# Altium schematic sheet Scheme VHF-Unit.SchDoc: VHF Unit
size A3; Date: 2018-03-27; DrawnBy: Josef Lundberg; Engineer: Josef Lundberg; Organization: Followit; DocumentNumber: 1; Revision: 1; SheetNumber: 1; SheetTotal: 1; Time: 2018-04-04; DocumentName: VHF Unit; ModifiedDate: 2018-04-04; ProjectName: VHF Unit
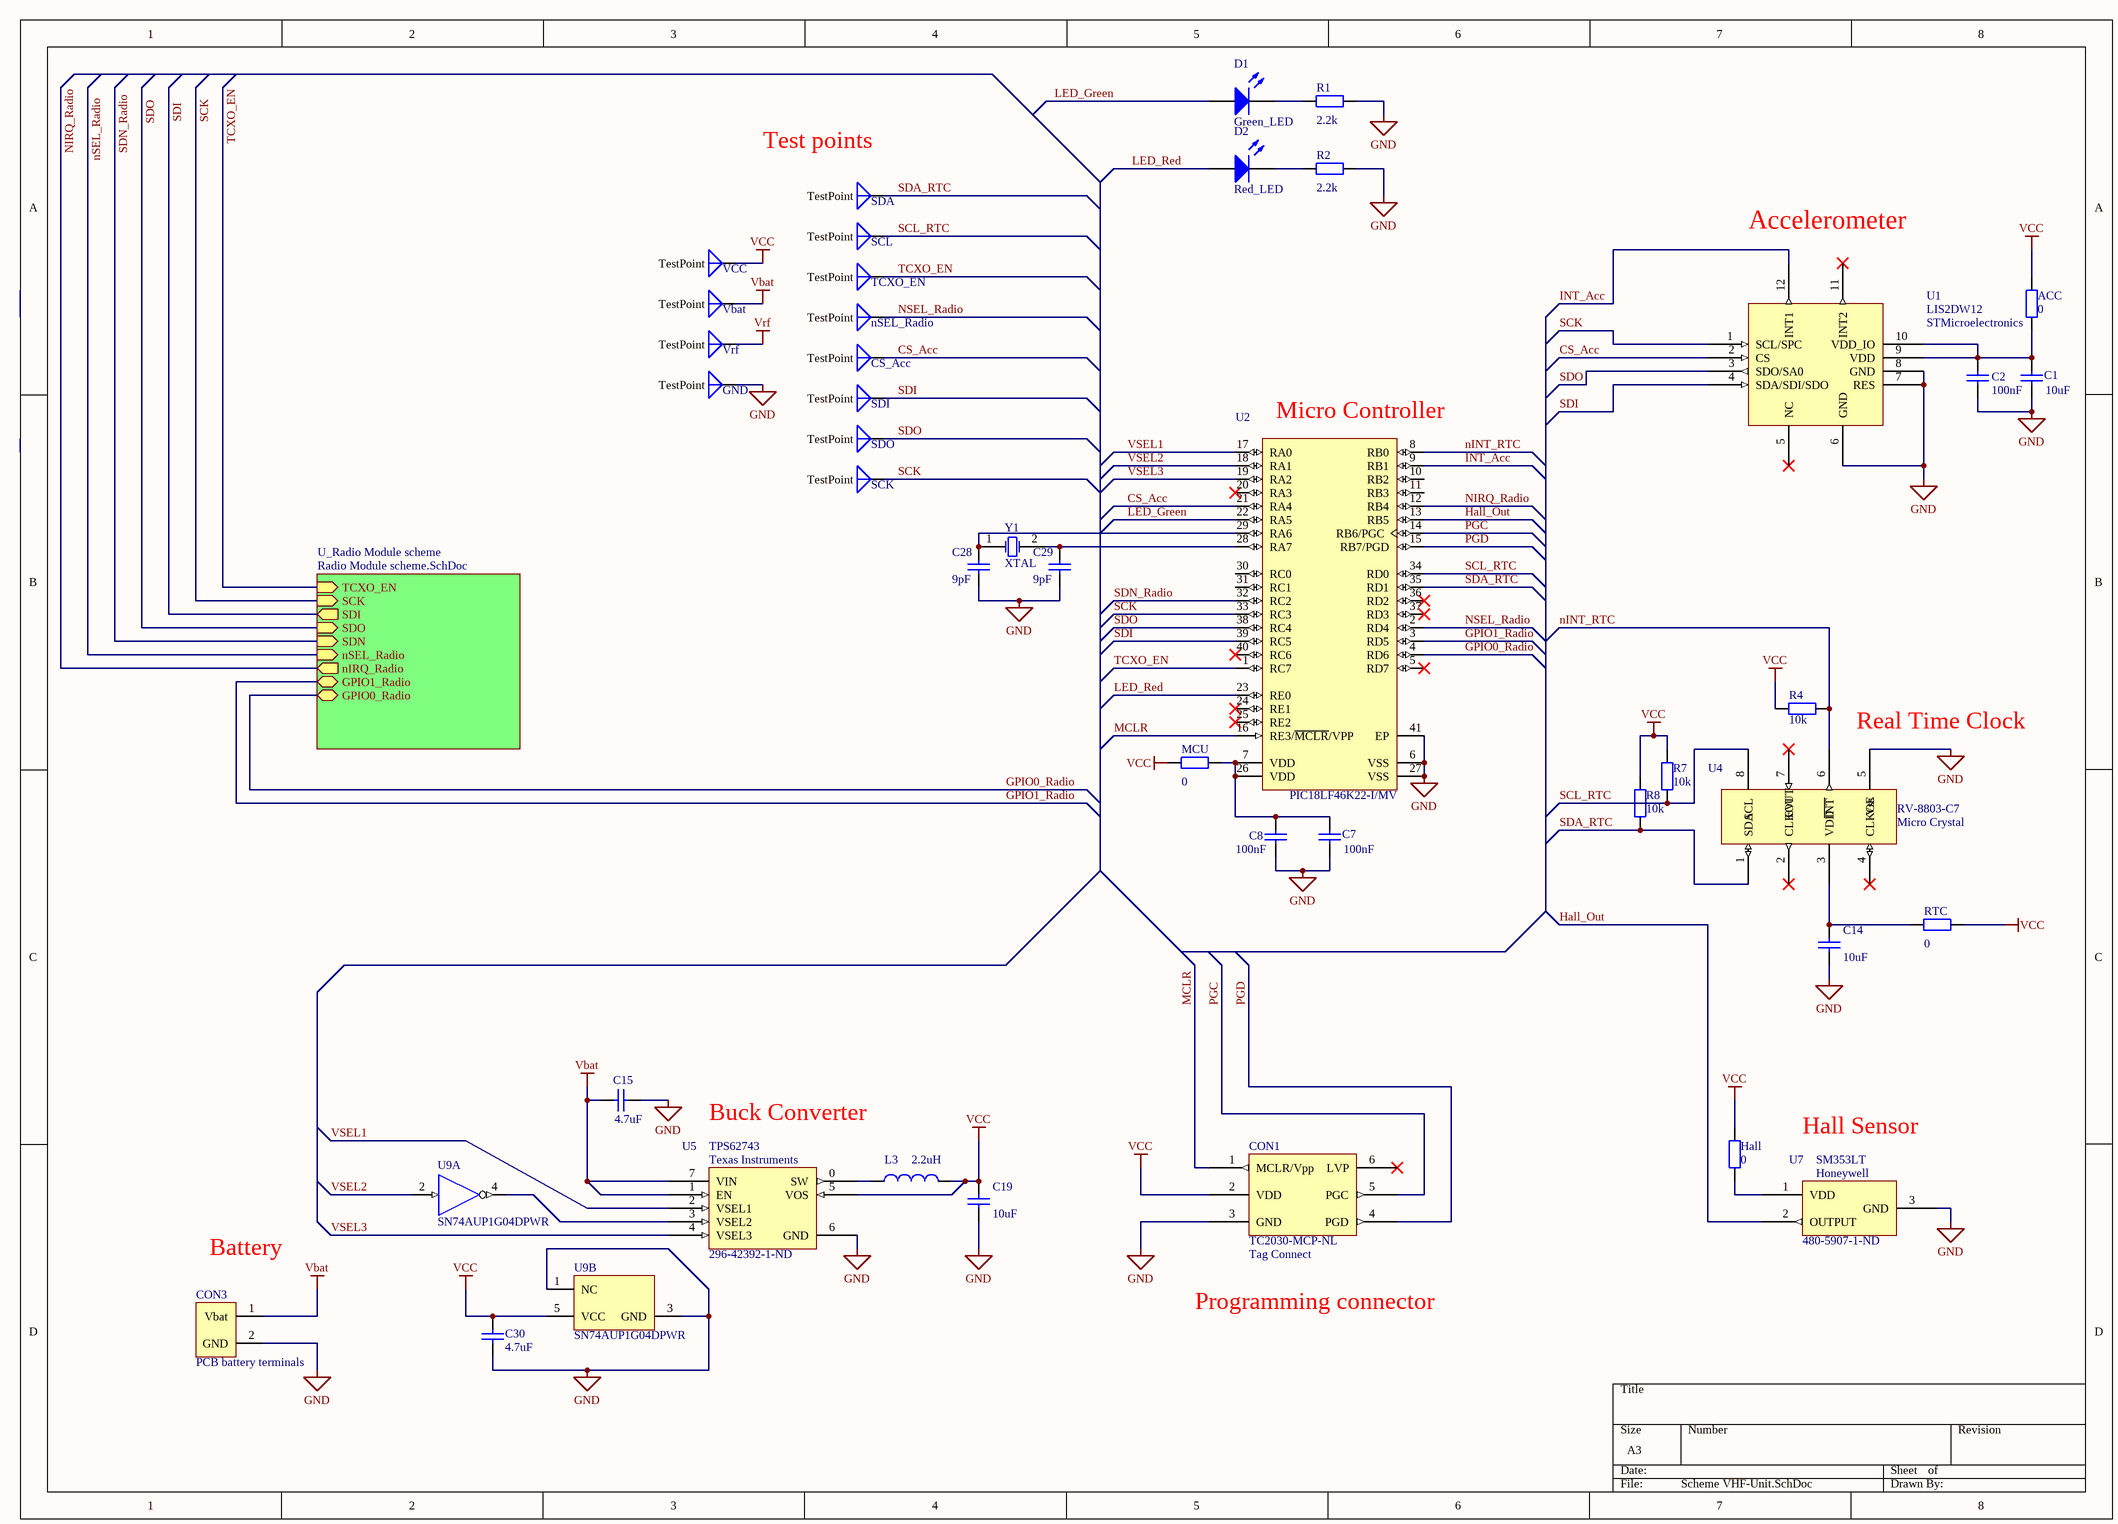
[diagram p0: Scheme VHF-Unit.SchDoc]

## Parts
ACC  value 0  [0402_SMD_RES_0_Ohm]  (hidden comment: Res2)
C1  value 10uF  [0402_CAP]
C2  value 100nF  [0402_CAP]
C7  value 100nF  [0402_CAP]  (hidden comment: Cap Semi)
C8  value 100nF  [0402_CAP]  (hidden comment: Cap Semi)
C14  value 10uF  [0402_CAP]  (hidden comment: Cap Semi)
C15  value 4.7uF  [0402_CAP]  (hidden comment: Cap Semi)
C19  value 10uF  [0402_CAP]  (hidden comment: Cap Semi)
C28  value 9pF  [0402_CAP]  (hidden comment: Cap Semi)
C29  value 9pF  [0402_CAP]  (hidden comment: Cap Semi)
C30  value 4.7uF  [0402_CAP]  (hidden comment: Cap Semi)
CON1  TC2030-MCP-NL  Mfr 1: Tag Connect  [TAG-CONNECT]
CON3  PCB battery terminals  [JST-PH]
CS_Acc  Antenna  [TestPoint]  (value not drawn)
D1  Green_LED  [0603_LED]
D2  Red_LED  [0603_LED]
GND  Antenna  [TestPoint]  (value not drawn)
Hall  value 0  [0402_SMD_RES_0_Ohm]  (hidden comment: Res2)
L3  value 2.2uH  [0402_CAP]  (hidden comment: Inductor)
MCU  value 0  [0402_SMD_RES_0_Ohm]  (hidden comment: Res2)
nSEL_Radio  Antenna  [TestPoint]  (value not drawn)
R1  value 2.2k  [0402_RES]  (hidden comment: Res2)
R2  value 2.2k  [0402_RES]  (hidden comment: Res2)
R4  value 10k  [0402_RES]  (hidden comment: Res2)
R7  value 10k  [0402_RES]  (hidden comment: Res2)
R8  value 10k  [0402_RES]  (hidden comment: Res2)
RTC  value 0  [0402_SMD_RES_0_Ohm]  (hidden comment: Res2)
SCK  Antenna  [TestPoint]  (value not drawn)
SCL  Antenna  [TestPoint]  (value not drawn)
SDA  Antenna  [TestPoint]  (value not drawn)
SDI  Antenna  [TestPoint]  (value not drawn)
SDO  Antenna  [TestPoint]  (value not drawn)
TCXO_EN  Antenna  [TestPoint]  (value not drawn)
U1  LIS2DW12  Mfr 1: STMicroelectronics  [LGA12C50P4X4_200X200X70 Low Density]
U2  PIC18LF46K22-I/MV  [MCHP-UQFN-MV40_M]
U4  RV-8803-C7  Mfr 1: Micro Crystal  [LGA8C90P4X2_320X150X80]
U5  TPS62743  Mfr 1: Texas Instruments  Supplier Part Number 1: 296-42392-1-ND  [BGA8C40P2X4_87X156X50]
U7  SM353LT  Mfr 1: Honeywell  Supplier Part Number 1: 480-5907-1-ND  [SOT95P280X140-3N]
U9  SN74AUP1G04DPWR  [DSF0006A_V]  (parts A,B of 2)
Vbat  Antenna  [TestPoint]  (value not drawn)
VCC  Antenna  [TestPoint]  (value not drawn)
Vrf  Antenna  [TestPoint]  (value not drawn)
Y1  XTAL  [ABS05-XTAL]

## Sub-sheets
U_Radio Module scheme = Radio Module scheme.SchDoc: TCXO_EN (in), SCK (in), SDI (out), SDO (in), SDN (in), nSEL_Radio (in), nIRQ_Radio (out), GPIO1_Radio (bidir), GPIO0_Radio (bidir)

## Nets
GND: C1.1 C2.1 C7.1 C8.1 C14.1 C15.1 C19.1 C28.1 C29.1 C30.1 CON1.3(GND) CON3.2(GND) GND.1(TestPoint) R1.2 R2.2 U1.6(GND) U1.7(RES) U1.8(GND) U2.6(VSS) U2.27(VSS) U2.41(EP) U4.5(Vss) U5.6(GND) U7.3(GND) U9.1(NC) U9.3(GND)
Vbat: C15.2 CON3.1(Vbat) U5.1(EN) U5.7(VIN) Vbat.1(TestPoint)
VCC: ACC.2 C19.2 C30.2 CON1.2(VDD) Hall.2 L3.2 MCU.1 R4.1 R7.2 R8.2 RTC.2 U5.5(VOS) U9.5(VCC) VCC.1(TestPoint)
Vrf: Vrf.1(TestPoint)
CS_Acc: CS_Acc.1(TestPoint) U1.2(CS) U2.21(RA4)
GPIO0_Radio: U2.4(RD6) ; sheet U_Radio Module scheme/GPIO0_Radio
GPIO1_Radio: U2.3(RD5) ; sheet U_Radio Module scheme/GPIO1_Radio
Hall_Out: U2.13(RB5) U7.2(OUTPUT)
INT_Acc: U1.12(INT1) U2.9(RB1)
LED_Green: D1.1(A) U2.22(RA5)
LED_Red: D2.1(A) U2.23(RE0)
MCLR: CON1.1(MCLR/Vpp) U2.16(RE3/~{MCLR}/VPP)
nINT_RTC: R4.2 U2.8(RB0) U4.6(~{INT})
NIRQ_Radio: U2.12(RB4) ; sheet U_Radio Module scheme/nIRQ_Radio
nSEL_Radio: nSEL_Radio.1(TestPoint) U2.2(RD4) ; sheet U_Radio Module scheme/nSEL_Radio
PGC: CON1.5(PGC) U2.14(RB6/PGC)
PGD: CON1.4(PGD) U2.15(RB7/PGD)
SCK: SCK.1(TestPoint) U1.1(SCL/SPC) U2.33(RC3) ; sheet U_Radio Module scheme/SCK
SCL_RTC: R7.1 SCL.1(TestPoint) U2.34(RD0) U4.8(SCL)
SDA_RTC: R8.1 SDA.1(TestPoint) U2.35(RD1) U4.1(SDA)
SDI: SDI.1(TestPoint) U1.4(SDA/SDI/SDO) U2.39(RC5) ; sheet U_Radio Module scheme/SDI
SDN_Radio: U2.32(RC2) ; sheet U_Radio Module scheme/SDN
SDO: SDO.1(TestPoint) U1.3(SDO/SA0) U2.38(RC4) ; sheet U_Radio Module scheme/SDO
TCXO_EN: TCXO_EN.1(TestPoint) U2.1(RC7) ; sheet U_Radio Module scheme/TCXO_EN
VSEL1: U2.17(RA0) U5.2(VSEL1)
VSEL2: U2.18(RA1) U9.2(A)
VSEL3: U2.19(RA2) U5.4(VSEL3)
NetACC_1: ACC.1 C1.2 C2.2 U1.9(VDD) U1.10(VDD_IO)
NetC7_2: C7.2 C8.2 MCU.2 U2.7(VDD) U2.26(VDD)
NetC14_2: C14.2 RTC.1 U4.3(VDD)
NetC28_2: C28.2 U2.29(RA6) Y1.1(OSC1)
NetC29_2: C29.2 U2.28(RA7) Y1.2(OSC2)
NetD1_2: D1.2(K) R1.1
NetD2_2: D2.2(K) R2.1
NetHall_1: Hall.1 U7.1(VDD)
NetL3_1: L3.1 U5.0(SW)
NetU5_3: U5.3(VSEL2) U9.4(Y)

Not connected (* = marked no-connect by the designer): CON1 6(LVP)*; U1 5(NC)* 11(INT2)*; U2 5(RD7)* 10(RB2) 11(RB3) 20(RA3)* 24(RE1)* 25(RE2)* 30(RC0) 31(RC1) 36(RD2)* 37(RD3)* 40(RC6)*; U4 2(CLKOUT)* 4(CLKOE)* 7(EVI)*

## Notes on the sheet
- (near SDA) Test points
- Accelerometer
- (near U2) Micro Controller
- Real Time Clock
- Buck Converter
- Hall Sensor
- Battery
- Programming connector

## Library data of the parts
ACC Hall MCU R1 R2 R4 R7 R8 RTC = Res2: Resistor; Published: 8-Jun-2000; LatestRevisionDate: 17-Jul-2002; LatestRevisionNote: Re-released for DXP Platform.; PackageReference: AXIAL-0.4; Publisher: Altium Limited; PackageDescription: Axial Device, Thru-Hole; 2 Leads; 0.4 in Pin Spacing
  ACC Hall RTC: Supplier 1: Digi-Key; Supplier Part Number 1: 311-0.0LBCT-ND
  R4 R7 R8: Supplier 1: Digi-Key; Supplier Part Number 1: 311-2217-1-ND
C1 C2 C7 C8 C14 C15 C19 C28-C30 = Cap Semi: Capacitor (Semiconductor SIM Model); Published: 8-Jun-2000; LatestRevisionDate: 29-May-2009; LatestRevisionNote: IPC-7351 Footprint Added.; PackageReference: C1206; Publisher: Altium Limited; PackageDescription: Chip Capacitor
  C7 C8 C28 C29: Supplier 1: Farnell; Supplier 2: Digi-Key
CON1 = TC2030-MCP-NL: Tag Connect programming connector
CON3 = Battery connenctor: 2 pin Battery Connectors
CS_Acc GND nSEL_Radio SCK SCL SDA SDI SDO TCXO_EN Vbat VCC Vrf = TestPoint: Testpoint connector
D1 D2 = LED2: Typical RED, GREEN, YELLOW, AMBER GaAs LED; Published: 8-Jun-2000; LatestRevisionDate: 17-Jul-2002; LatestRevisionNote: Re-released for DXP Platform.; PackageVersion: Feb-2002; PackageReference: 3.2X1.6X1.1; Publisher: Altium Limited; PackageDescription: SM LED; 2 Flat Leads
L3 = Inductor: Code_IEC: 1005; Published: 8-Jun-2000; LatestRevisionDate: 29-May-2009; LatestRevisionNote: IPC-7351 Footprint Added.; PackageReference: 0402-A; Publisher: Altium Limited; PackageDescription: Chip Inductor; Code_JEITA: 0402
U1 = LIS2DW12: Digital output motion sensor 3-axis
U2 = PIC18LF46K22-I/MV: Low-Power, High-Performance Microcontroller with XLP Technology, 16 MHz, 35 I/O, -40 to 85 degC, 40-pin UQFN (MV40), Tube; Manufacturer: Microchip; # of A/D Channels: 28; Digital Communication: 2-A/E/USART, 2-MSSP(SPI/I2C); EEPROM Data Memory (bytes): 1024; I/O Pins: 35; Internal Oscillator: 16 MHz, 31 kHz; Max. CPU Speed MHz: 16; Memory Type: Flash; Operation Voltage Range: 1.8V - 3.6V; Program Memory KBytes: 64; Program Memory KWords: 32; RAM: 3896; Timers: 3 - 8-bit, 4 - 16-bit; DatasheetVersion: Rev. F; PackageVersion: C04-156A, 04/2013; PackageReference: UQFN-MV40; PackageDescription: 40-Lead Plastic Ultra Thin Quad Flat, No Lead Package, Body 5 x 5 mm, Pitch 0.4 mm; Supplier 1: Digi-Key; Supplier Part Number 1: PIC18LF46K22-I/MV-ND; Supplier 2: Farnell; Supplier Part Number 2: 2318031; Supplier 3: Newark; Supplier Part Number 3: 23T3186; Supplier 4: Mouser; Supplier Part Number 4: 579-PIC18LF46K22-IMV; Packing: TUBE; Mounting Technology: Surface Mount; PartNumber: PIC18LF46K22-I/MV; ComponentLink1Description: Datasheet; ComponentLink1URL: http://ww1.microchip.com/downloads/en/DeviceDoc/41412F.pdf; ComponentLink2Description: Package Specification; ComponentLink2URL: http://www.microchip.com/stellent/groups/techpub_sg/documents/packagingspec/en012702.pdf; ComponentLink3Description: URL Link1; ComponentLink3URL: Product URL:http://www.microchip.com/datasheet/PIC18F46K22
U5 = TPS62743: High EfficiencyBuck Converterwith Ultra-lowQuiescentCurrent; Supplier 1: Digi-Key
U7 = SM353LT: Magnetoresistive Sensor ICs; Supplier 1: Digi-Key
U9 = SN74AUP1G04DPWR: Low-Power Single Inverter Gate, DPW0004A, LARGE T&R; Manufacturer: Texas Instruments; VCC(Min)(V): 0.8; VCC(Max)(V): 3.6; Output Type: CMOS; ICC @ Nom Voltage(Max)(mA): 0.0009; Bits(#): 1; F @ Nom Voltage(Max)(Mhz): 100; Rating: Catalog; Technology Family: AUP; Voltage(Nom)(V): 0.8,1.2,1.5,1.8,2.5,3.3; Schmitt Trigger: No; Output Drive (IOL/IOH)(Max)(mA): 20/-20; tpd @ Nom Voltage(Max)(ns): 25.4,16,10.8,9.2,6.5,5.4; Logic: Inverting; Sub-Family: Inverting Buffer/Driver; DatasheetVersion: SCES571K; PackageReference: DPW0004A; Supplier 1: Mouser; Supplier Part Number 1: 595-SN74AUP1G04DPWR; Supplier 2: Digi-Key; Supplier Part Number 2: 296-38019-2-ND; Supplier 3: Digi-Key; Supplier Part Number 3: 296-38019-1-ND; Supplier 4: Digi-Key; Supplier Part Number 4: 296-38019-6-ND; Generic Part Number: SN74AUP1G04; Input Type: CMOS; Operating Temperature Range(C): -40 to 85; 3-State Output: No; PartNumber: SN74AUP1G04DPWR; ComponentLink1Description: Manufacturer URL; ComponentLink1URL: http://www.ti.com/; ComponentLink2Description: Datasheet; ComponentLink2URL: http://www.ti.com/lit/ds/symlink/sn74aup1g04.pdf
Y1 = XTAL: Crystal Oscillator; Published: 8-Jun-2000; LatestRevisionDate: 17-Jul-2002; LatestRevisionNote: Re-released for DXP Platform.; PackageReference: R38; Publisher: Altium Limited; PackageDescription: Crystal, Thru-Hole; 2 Leads; Body 3.1 x 8.2 mm (Dia.xH)